# Altium project 新救援底盘&机械臂.PrjPcb
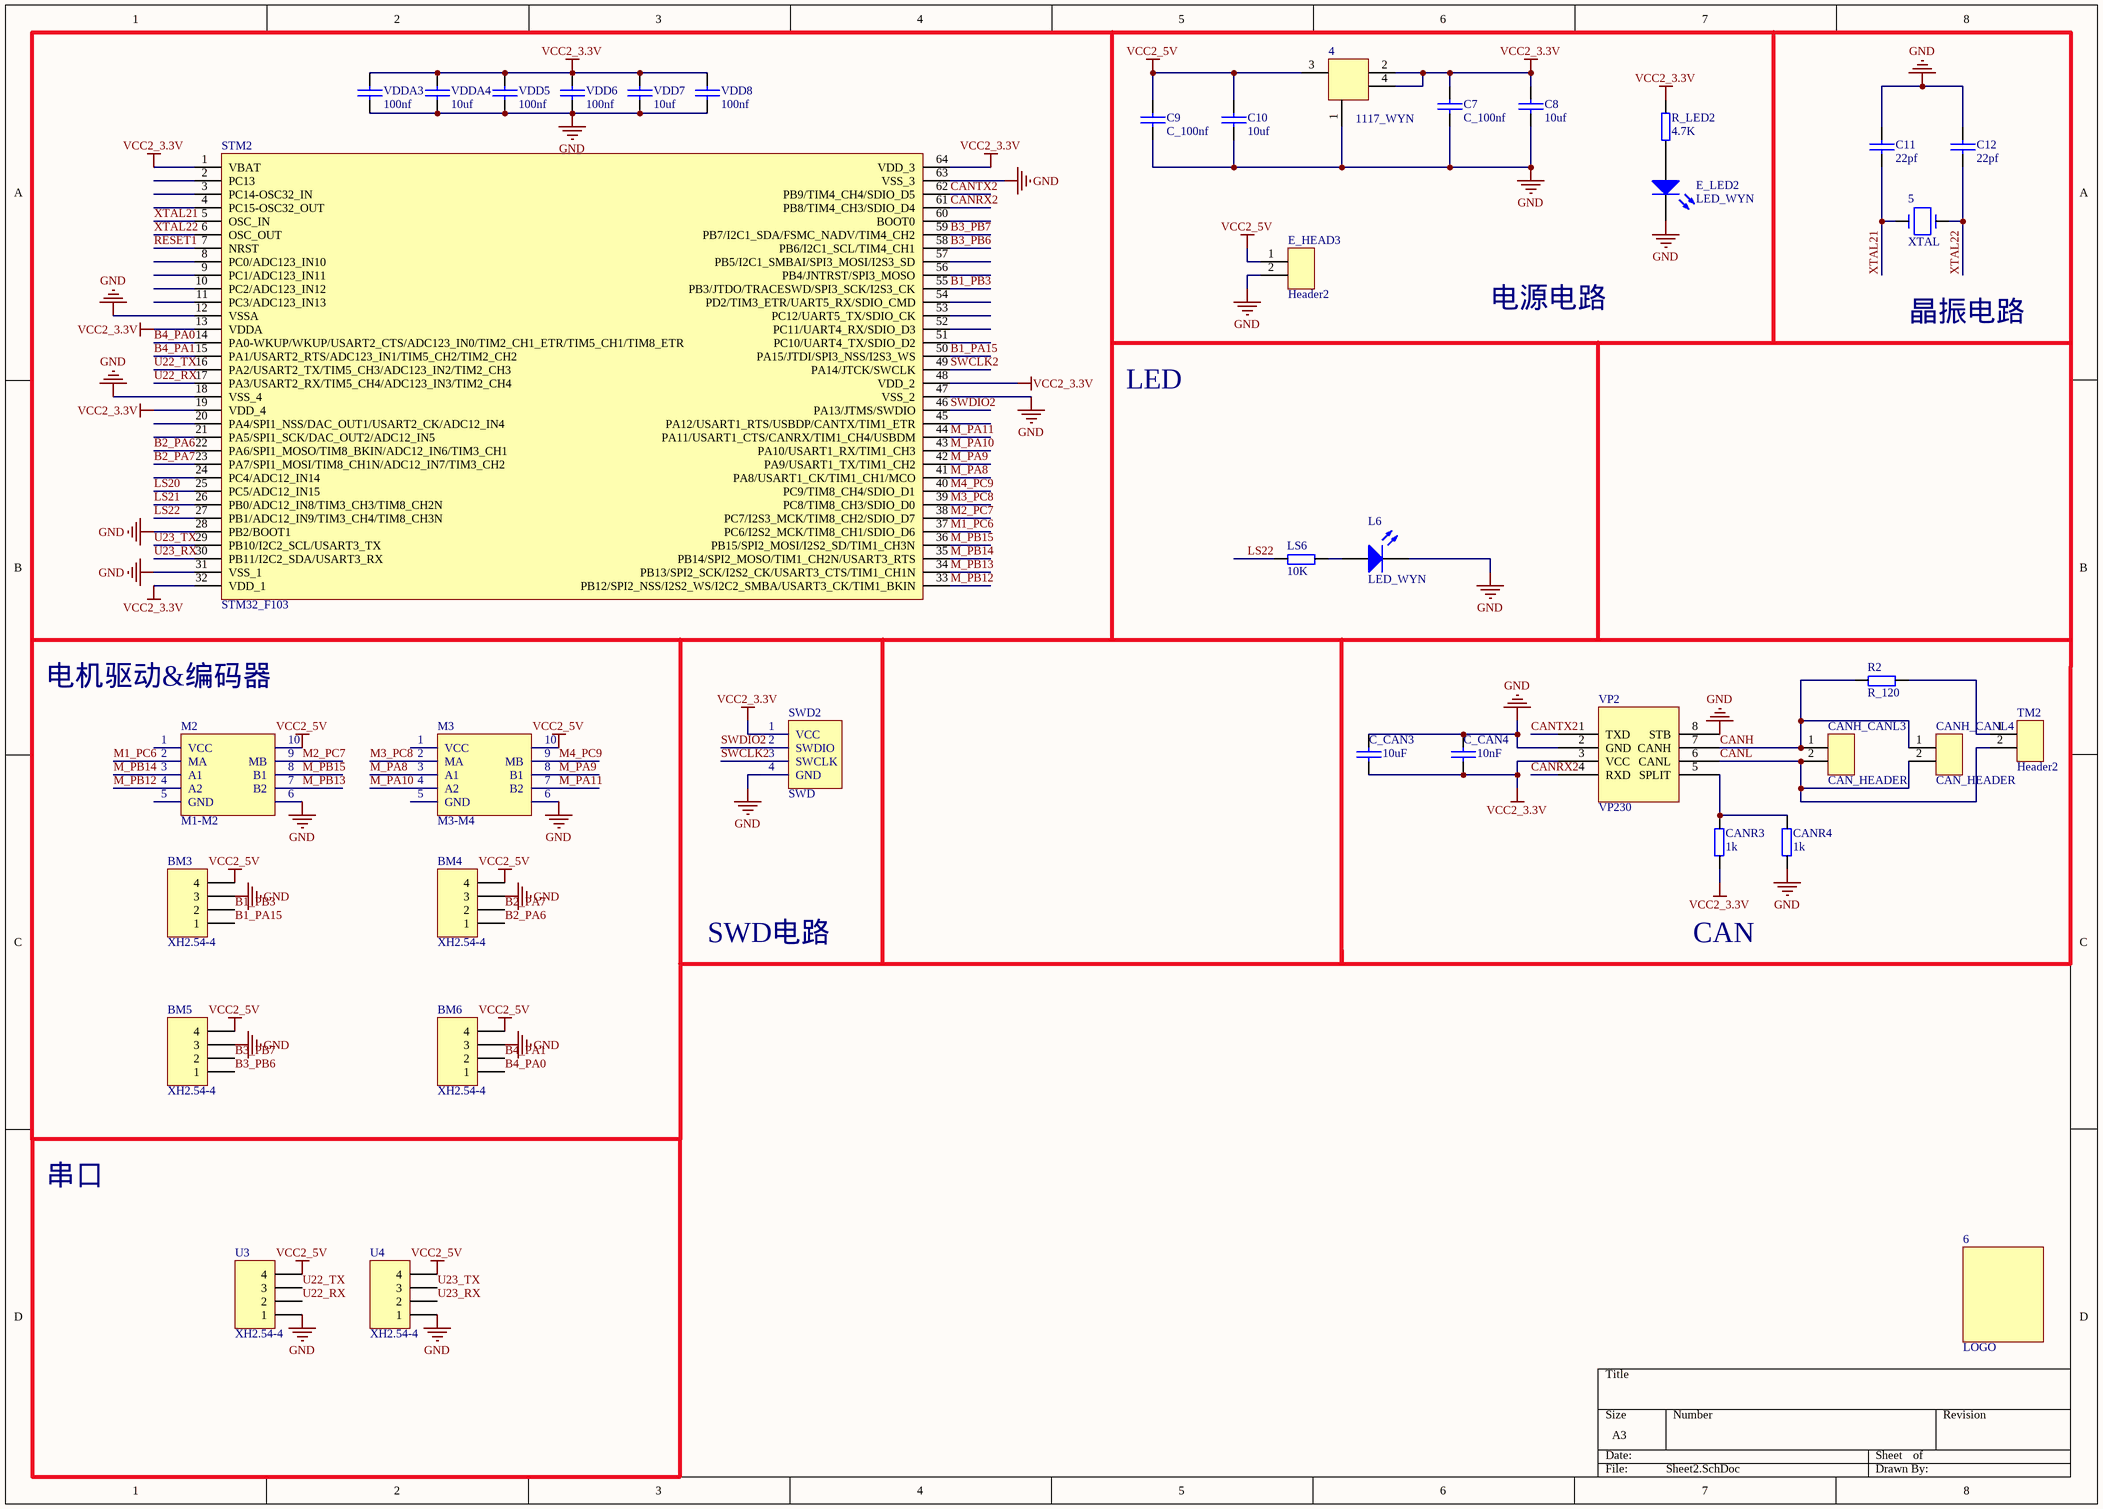
[diagram p0: Sheet2.SchDoc]
1 sheet, 39 parts. Net scope: global (net labels, ports and power ports of the same name join across sheets).
Board file: PCB1.PcbDoc

## Sheet Sheet2.SchDoc
size A3

### Parts
4  1117_WYN  [SOT223_M]
5  XTAL  [XTAL_D]
6  LOGO  [LOGO]
BM3  XH2.54-4  [XH2.54-4]
BM4  XH2.54-4  [XH2.54-4]
BM5  XH2.54-4  [XH2.54-4]
BM6  XH2.54-4  [XH2.54-4]
C7  C_100nf  [0603]
C8  10uf  [0603]
C9  C_100nf  [0603]
C10  10uf  [0603]
C11  22pf  [0603]
C12  22pf  [0603]
C_CAN3  10uF  [0603]
C_CAN4  10nF  [0603]
CANH_CANL3  CAN_HEADER  [CAN信号]
CANH_CANL4  CAN_HEADER  [CAN信号]
CANR3  1k  [0603_WYH]
CANR4  1k  [0603_WYH]
E_HEAD3  Header2  [POWER]
E_LED2  LED_WYN  [0603]
L6  LED_WYN  [0603]
LS6  10K  [0603_WYH]
M2  M1-M2  [JTAG_10to20]
M3  M3-M4  [JTAG_10to20]
R2  R_120  [0603_WYH]
R_LED2  4.7K  [0603]
STM2  STM32_F103  [STM32TSQFP50P1200X1200X160-64N]
SWD2  SWD  [HDR1X5]
TM2  Header2  [HDR1X2]
U3  XH2.54-4  [XH2.54-4]
U4  XH2.54-4  [XH2.54-4]
VDD5  100nf  [0603]
VDD6  100nf  [0603]
VDD7  10uf  [0603]
VDD8  100nf  [0603]
VDDA3  100nf  [0603]
VDDA4  10uf  [0603]
VP2  VP230  [VP230]

### Nets
GND: 4.1 BM3.3 BM4.3 BM5.3 BM6.3 C7.2 C8.2 C9.2 C10.2 C11.1 C12.1 C_CAN3.1 C_CAN4.1 CANR4.2 E_HEAD3.2 E_LED2.2(K) L6.2(K) M2.6 M3.6 STM2.12(VSSA) STM2.18(VSS_4) STM2.28(PB2/BOOT1) STM2.31(VSS_1) STM2.47(VSS_2) STM2.63(VSS_3) SWD2.4(GND) U3.1 U4.1 VDD5.2 VDD6.2 VDD7.2 VDD8.2 VDDA3.2 VDDA4.2 VP2.2(GND) VP2.8(STB)
VCC2_3.3V: 4.2 4.4 C7.1 C8.1 C_CAN3.2 C_CAN4.2 CANR3.2 R_LED2.2 STM2.1(VBAT) STM2.13(VDDA) STM2.19(VDD_4) STM2.32(VDD_1) STM2.48(VDD_2) STM2.64(VDD_3) SWD2.1(VCC) VDD5.1 VDD6.1 VDD7.1 VDD8.1 VDDA3.1 VDDA4.1 VP2.3(VCC)
VCC2_5V: 4.3 BM3.4 BM4.4 BM5.4 BM6.4 C9.1 C10.1 E_HEAD3.1 M2.10 M3.10 U3.4 U4.4
B1_PA15: BM3.1 STM2.50(PA15/JTDI/SPI3_NSS/I2S3_WS)
B1_PB3: BM3.2 STM2.55(PB3/JTDO/TRACESWD/SPI3_SCK/I2S3_CK)
B2_PA6: BM4.1 STM2.22(PA6/SPI1_MOSO/TIM8_BKIN/ADC12_IN6/TIM3_CH1)
B2_PA7: BM4.2 STM2.23(PA7/SPI1_MOSI/TIM8_CH1N/ADC12_IN7/TIM3_CH2)
B3_PB6: BM5.1 STM2.58(PB6/I2C1_SCL/TIM4_CH1)
B3_PB7: BM5.2 STM2.59(PB7/I2C1_SDA/FSMC_NADV/TIM4_CH2)
B4_PA0: BM6.1 STM2.14(PA0-WKUP/WKUP/USART2_CTS/ADC123_IN0/TIM2_CH1_ETR/TIM5_CH1/TIM8_ETR)
B4_PA1: BM6.2 STM2.15(PA1/USART2_RTS/ADC123_IN1/TIM5_CH2/TIM2_CH2)
CANH: CANH_CANL3.1 CANH_CANL4.1 R2.1 VP2.7(CANH)
CANL: CANH_CANL3.2 CANH_CANL4.2 TM2.2 VP2.6(CANL)
CANRX2: STM2.61(PB8/TIM4_CH3/SDIO_D4) VP2.4(RXD)
CANTX2: STM2.62(PB9/TIM4_CH4/SDIO_D5) VP2.1(TXD)
LS20: STM2.25(PC5/ADC12_IN15)
LS21: STM2.26(PB0/ADC12_IN8/TIM3_CH3/TIM8_CH2N)
LS22: LS6.1 STM2.27(PB1/ADC12_IN9/TIM3_CH4/TIM8_CH3N)
M1_PC6: M2.2(MA) STM2.37(PC6/I2S2_MCK/TIM8_CH1/SDIO_D6)
M2_PC7: M2.9(MB) STM2.38(PC7/I2S3_MCK/TIM8_CH2/SDIO_D7)
M3_PC8: M3.2(MA) STM2.39(PC8/TIM8_CH3/SDIO_D0)
M4_PC9: M3.9(MB) STM2.40(PC9/TIM8_CH4/SDIO_D1)
M_PA8: M3.3(A1) STM2.41(PA8/USART1_CK/TIM1_CH1/MCO)
M_PA9: M3.8(B1) STM2.42(PA9/USART1_TX/TIM1_CH2)
M_PA10: M3.4(A2) STM2.43(PA10/USART1_RX/TIM1_CH3)
M_PA11: M3.7(B2) STM2.44(PA11/USART1_CTS/CANRX/TIM1_CH4/USBDM)
M_PB12: M2.4(A2) STM2.33(PB12/SPI2_NSS/I2S2_WS/I2C2_SMBA/USART3_CK/TIM1_BKIN)
M_PB13: M2.7(B2) STM2.34(PB13/SPI2_SCK/I2S2_CK/USART3_CTS/TIM1_CH1N)
M_PB14: M2.3(A1) STM2.35(PB14/SPI2_MOSO/TIM1_CH2N/USART3_RTS)
M_PB15: M2.8(B1) STM2.36(PB15/SPI2_MOSI/I2S2_SD/TIM1_CH3N)
RESET1: STM2.7(NRST)
SWCLK2: STM2.49(PA14/JTCK/SWCLK) SWD2.3(SWCLK)
SWDIO2: STM2.46(PA13/JTMS/SWDIO) SWD2.2(SWDIO)
U22_RX: STM2.17(PA3/USART2_RX/TIM5_CH4/ADC123_IN3/TIM2_CH4) U3.2
U22_TX: STM2.16(PA2/USART2_TX/TIM5_CH3/ADC123_IN2/TIM2_CH3) U3.3
U23_RX: STM2.30(PB11/I2C2_SDA/USART3_RX) U4.2
U23_TX: STM2.29(PB10/I2C2_SCL/USART3_TX) U4.3
XTAL21: 5.1 C11.2 STM2.5(OSC_IN)
XTAL22: 5.2 C12.2 STM2.6(OSC_OUT)
NetCANR3_1: CANR3.1 CANR4.1 VP2.5(SPLIT)
NetE_LED2_1: E_LED2.1(A) R_LED2.1
NetL6_1: L6.1(A) LS6.2
NetR2_2: R2.2 TM2.1

Not connected (* = marked no-connect by the designer): M2 1(VCC) 5(GND); M3 1(VCC) 5(GND); STM2 2(PC13) 3(PC14-OSC32_IN) 4(PC15-OSC32_OUT) 8(PC0/ADC123_IN10) 9(PC1/ADC123_IN11) 10(PC2/ADC123_IN12) 11(PC3/ADC123_IN13) 20(PA4/SPI1_NSS/DAC_OUT1/USART2_CK/ADC12_IN4) 21(PA5/SPI1_SCK/DAC_OUT2/ADC12_IN5) 24(PC4/ADC12_IN14) 45(PA12/USART1_RTS/USBDP/CANTX/TIM1_ETR) 51(PC10/UART4_TX/SDIO_D2) 52(PC11/UART4_RX/SDIO_D3) 53(PC12/UART5_TX/SDIO_CK) 54(PD2/TIM3_ETR/UART5_RX/SDIO_CMD) 56(PB4/JNTRST/SPI3_MOSO) 57(PB5/I2C1_SMBAI/SPI3_MOSI/I2S3_SD) 60(BOOT0)

### Notes on the sheet
- 电源电路
- 晶振电路
- LED
- 电机驱动&编码器
- SWD电路
- CAN
- 串口

### Library data of the parts
C7-C12 C_CAN3 C_CAN4 VDD5-VDD8 VDDA3 VDDA4 = CAP_WYN
CANR3 CANR4 LS6 R2 = R
M2 M3 = 电机接口
R_LED2 = RES_WYN